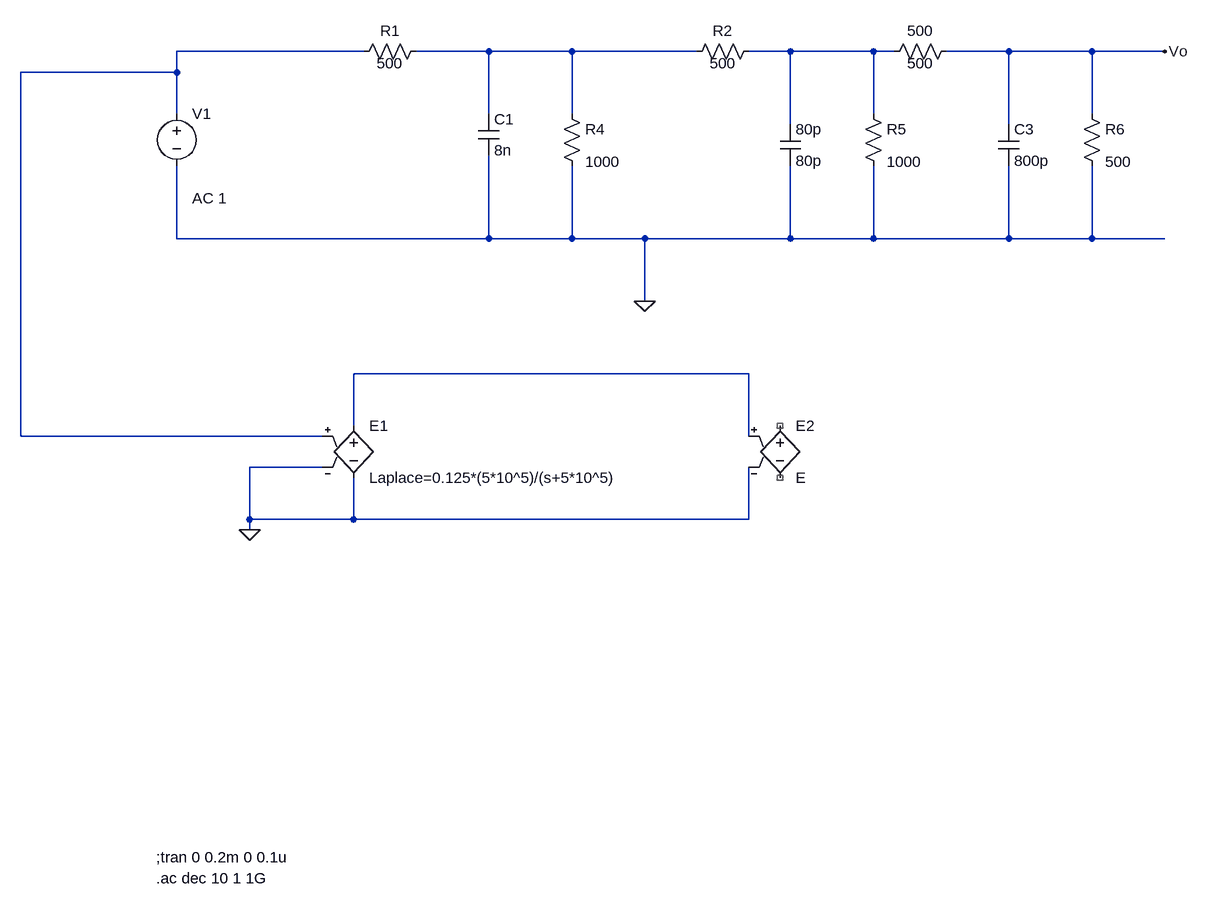
[diagram p0: schematic figure 1.1 MP1.asc]
figure 1.1 MP1.asc, the LTspice schematic file:
Version 4
SHEET 1 3424 1236
WIRE 144 -64 -144 -64
WIRE 336 -64 224 -64
WIRE 464 -64 336 -64
WIRE 656 -64 464 -64
WIRE 800 -64 736 -64
WIRE 928 -64 800 -64
WIRE 960 -64 928 -64
WIRE 1136 -64 1040 -64
WIRE 1264 -64 1136 -64
WIRE 1376 -64 1264 -64
WIRE -144 -32 -144 -64
WIRE -144 -32 -384 -32
WIRE -144 32 -144 -32
WIRE 336 32 336 -64
WIRE 464 32 464 -64
WIRE 928 32 928 -64
WIRE 1264 32 1264 -64
WIRE 800 48 800 -64
WIRE 1136 48 1136 -64
WIRE -144 224 -144 112
WIRE 336 224 336 96
WIRE 336 224 -144 224
WIRE 464 224 464 112
WIRE 464 224 336 224
WIRE 576 224 464 224
WIRE 800 224 800 112
WIRE 800 224 576 224
WIRE 928 224 928 112
WIRE 928 224 800 224
WIRE 1136 224 1136 112
WIRE 1136 224 928 224
WIRE 1264 224 1264 112
WIRE 1264 224 1136 224
WIRE 1376 224 1264 224
WIRE 576 320 576 224
WIRE 736 432 128 432
WIRE 128 512 128 432
WIRE -384 528 -384 -32
WIRE 80 528 -384 528
WIRE 736 528 736 432
WIRE 80 576 -32 576
WIRE -32 656 -32 576
WIRE 128 656 128 592
WIRE 128 656 -32 656
WIRE 736 656 736 576
WIRE 736 656 128 656
WIRE -32 672 -32 656
FLAG 576 320 0
FLAG 1376 -64 Vo
FLAG -32 672 0
SYMBOL res 240 -80 R90
WINDOW 0 0 56 VBottom 2
WINDOW 3 50 56 VBottom 2
SYMATTR InstName R1
SYMATTR Value 500
SYMBOL res 752 -80 R90
WINDOW 0 0 56 VBottom 2
WINDOW 3 50 56 VBottom 2
SYMATTR InstName R2
SYMATTR Value 500
SYMBOL res 1056 -80 R90
WINDOW 0 0 56 VBottom 2
WINDOW 3 50 56 VBottom 2
SYMATTR InstName 500
SYMATTR Value 500
SYMBOL res 448 16 R0
WINDOW 3 36 90 Left 2
SYMATTR Value 1000
SYMATTR InstName R4
SYMBOL res 912 16 R0
WINDOW 3 36 90 Left 2
SYMATTR Value 1000
SYMATTR InstName R5
SYMBOL res 1248 16 R0
WINDOW 3 36 90 Left 2
SYMATTR Value 500
SYMATTR InstName R6
SYMBOL e 128 496 R0
SYMATTR InstName E1
SYMATTR Value Laplace=0.125*(5*10^5)/(s+5*10^5)
SYMBOL cap 784 48 R0
SYMATTR InstName 80p
SYMATTR Value 80p
SYMBOL cap 320 32 R0
SYMATTR InstName C1
SYMATTR Value 8n
SYMBOL cap 1120 48 R0
SYMATTR InstName C3
SYMATTR Value 800p
SYMBOL voltage -144 16 R0
WINDOW 123 24 146 Left 2
WINDOW 39 0 0 Left 0
SYMATTR Value2 AC 1
SYMATTR InstName V1
SYMATTR Value ""
SYMBOL e 784 496 R0
SYMATTR InstName E2
TEXT -176 1176 Left 2 !;tran 0 0.2m 0 0.1u
TEXT -176 1208 Left 2 !.ac dec 10 1 1G

The netlist it stands for:
* figure 1.1 MP1.asc
R1 N002 N001 500
R2 N003 N002 500
R§500 Vo N003 500
R4 N002 0 1000
R5 N003 0 1000
R6 Vo 0 500
E1 N004 0 N001 0 Laplace=0.125*(5*10^5)/(s+5*10^5)
C§80p N003 0 80p
C1 N002 0 8n
C3 Vo 0 800p
V1 N001 0 AC 1
E2 NC_01 NC_02 N004 0 E
;tran 0 0.2m 0 0.1u
.ac dec 10 1 1G
.backanno
.end